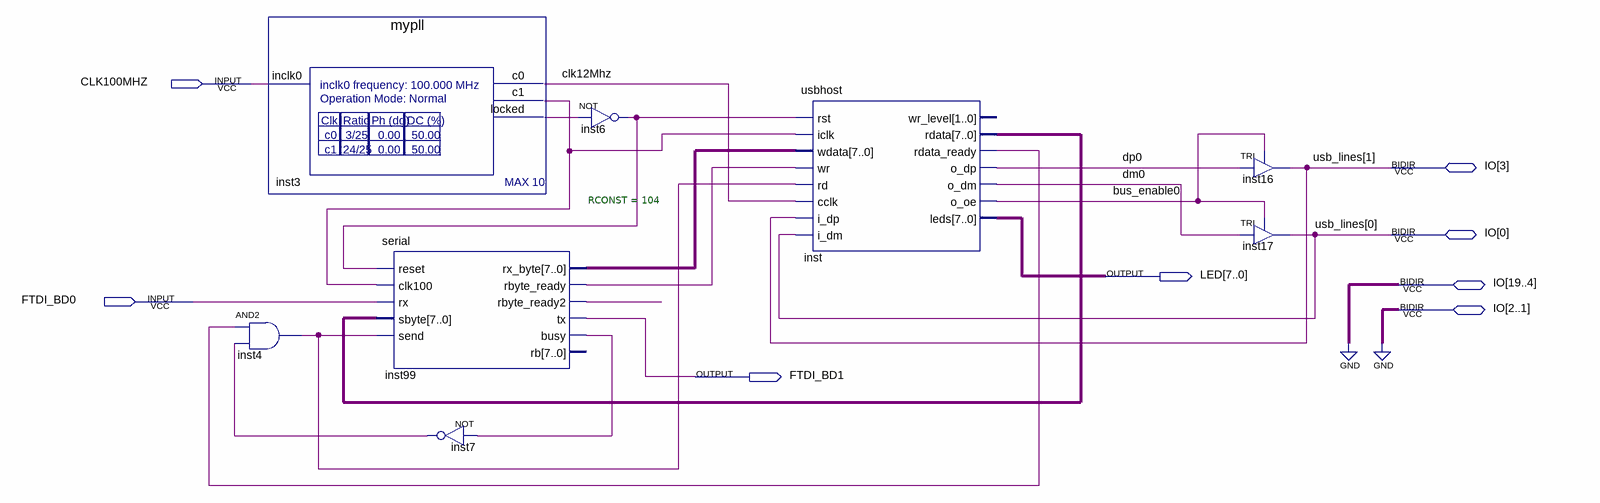
[diagram p0: schematic sheet]
// Quartus schematic max10.bdf as structural Verilog: 8 symbols, 8 pins
module max10 (
  input  CLK100MHZ,
  input  FTDI_BD0,
  inout  [19:0] IO,
  output [7:0] LED,
  output FTDI_BD1
);

  wire bus_enable0, clk12Mhz, dm0, dp0, inst3_c1, inst3_locked, inst4_out, inst6_out, inst7_out, inst99_busy,
       inst99_rbyte_ready, inst99_rbyte_ready2, inst_rdata_ready;
  wire [7:0] inst99_rx_byte, inst_rdata;

  and inst4 (inst4_out, inst_rdata_ready, inst7_out);
  mypll inst3 (.inclk0(CLK100MHZ), .c0(clk12Mhz), .c1(inst3_c1), .locked(inst3_locked));
  serial #(.RCONST(104)) inst99 (
    .reset(inst6_out), .clk100(inst3_c1), .rx(FTDI_BD0), .sbyte(inst_rdata), .send(inst4_out),
    .rx_byte(inst99_rx_byte), .rbyte_ready(inst99_rbyte_ready), .rbyte_ready2(inst99_rbyte_ready2),
    .tx(FTDI_BD1), .busy(inst99_busy));  // open: rb
  not inst7 (inst7_out, inst99_busy);
  not inst6 (inst6_out, inst3_locked);
  usbhost inst (
    .rst(inst6_out), .iclk(inst3_c1), .wdata(inst99_rx_byte), .wr(inst99_rbyte_ready), .rd(inst4_out),
    .cclk(clk12Mhz), .i_dp(IO[3]), .i_dm(IO[0]), .rdata(inst_rdata), .rdata_ready(inst_rdata_ready),
    .o_dp(dp0), .o_dm(dm0), .o_oe(bus_enable0), .leds(LED));  // open: wr_level
  TRI inst16 (.IN(dp0), .OE(bus_enable0), .OUT(IO[3]));
  TRI inst17 (.IN(dm0), .OE(bus_enable0), .OUT(IO[0]));
  // also tied to GND on the sheet: {IO[1], IO[2], IO[4], IO[5], IO[6], IO[7], IO[8], IO[9], IO[10], IO[11], IO[12], IO[13], IO[14], IO[15], IO[16], IO[17], IO[18], IO[19]}

  // Other names for the same wires on the sheet: usb_lines[1:0] = {IO[3], IO[0]}
endmodule
